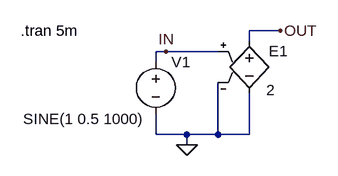
[diagram p0: schematic Fig_2-63_E-Source-test.asc]
Fig_2-63_E-Source-test.asc, the LTspice schematic file:
Version 4
SHEET 1 880 680
WIRE 272 80 224 80
WIRE 224 96 224 80
WIRE 96 112 80 112
WIRE 176 112 96 112
WIRE 80 128 80 112
WIRE 80 240 80 208
WIRE 128 240 80 240
WIRE 176 240 176 160
WIRE 176 240 128 240
WIRE 224 240 224 176
WIRE 224 240 176 240
WIRE 128 256 128 240
FLAG 128 256 0
FLAG 272 80 OUT
FLAG 96 112 IN
SYMBOL e 224 80 R0
WINDOW 0 30 31 Left 2
WINDOW 3 26 91 Left 2
SYMATTR InstName E1
SYMATTR Value 2
SYMBOL voltage 80 112 R0
WINDOW 3 -204 104 Left 2
WINDOW 123 0 0 Left 2
WINDOW 39 0 0 Left 2
SYMATTR Value SINE(1 0.5 1000)
SYMATTR InstName V1
TEXT -128 80 Left 2 !.tran 5m

The netlist it stands for:
* Fig_2-63_E-Source-test.asc
E1 OUT 0 IN 0 2
V1 IN 0 SINE(1 0.5 1000)
.tran 5m
.backanno
.end